# Altium project DCcom.PrjPcb
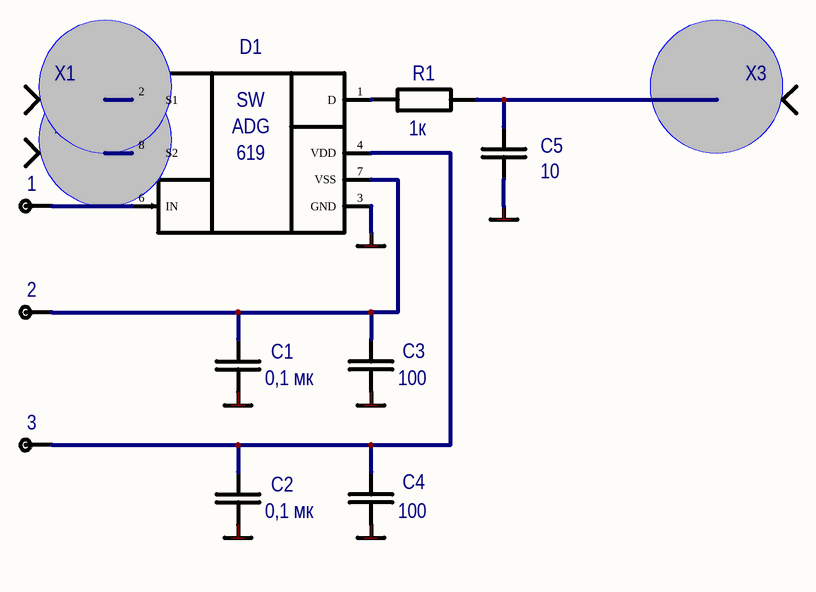
[diagram p0: DCCOM.SchDoc]
1 sheet, 19 parts. Net scope: global (net labels, ports and power ports of the same name join across sheets).
Board file: DCcom0038.PcbDoc

## Sheet DCCOM.SchDoc
size A4; SheetNumber: 1; SheetTotal: 1

### Parts
(Parts that share a designator on the sheet are numbered #1, #2 ... from top to bottom, then left to right.)
1  TP  [TP1]  (value not drawn)  (no BOM)
2  TP  [TP1]  (value not drawn)  (no BOM)
3  TP  [TP1]  (value not drawn)  (no BOM)
*#1  GND  (value not drawn)  (graphical)
*#2  GND  (value not drawn)  (graphical)
*#3  GND  (value not drawn)  (graphical)
*#4  GND  (value not drawn)  (graphical)
*#5  GND  (value not drawn)  (graphical)
*#6  GND  (value not drawn)  (graphical)
C1  0,1 мк  [CAPC1608N]
C2  0,1 мк  [CAPC1608N]
C3  100  [CAPC1005N]
C4  100  [CAPC1005N]
C5  10  [CAPC1608N]
D1  ADG619BRM  [TSOP65P490X110-8N]  (value not drawn)
R1  1к  [RESC1608L]
X1  СРГ-50-751ФВ  [TP0.6X1]  (value not drawn)
X2  СРГ-50-751ФВ  [TP0.6X1]  (value not drawn)
X3  СРГ-50-751ФВ  [TP0.6X1]  (value not drawn)

### Nets
GND: C1.1 C2.1 C3.2 C4.2 C5.1 D1.3(GND)
Net1_1: 1.1 D1.6(IN)
Net2_1: 2.1 C1.2 C3.1 D1.7(VSS)
Net3_1: 3.1 C2.2 C4.1 D1.4(VDD)
NetC5_2: C5.2 R1.1 X3.1
NetD1_1: D1.1(D) R1.2
NetD1_2: D1.2(S1) X1.1
NetD1_8: D1.8(S2) X2.1

### Notes on the sheet
- (in symbol ADG619BRM) SW; ADG; 619

### Library data of the parts
1-3 = TP: Test point
*#1-*#6 = GND: Корпус ЕСКД. Для "наложения" на штатный Power Bar
C1 C2 C5 = C0603: Чип-конденсатор; Name: 0603; Power/Voltage: {Voltage}; TKE/TKC: {TKE/TKC}; Tolerance: {Tolerance}; Value: {Value}; BCPId: *; Manufacturer: *; ManufacturerPartNumber: *; Type: Конденсатор
C3 C4 = C0402: Чип-конденсатор; Name: 0402; Power/Voltage: {Voltage}; TKE/TKC: {TKE/TKC}; Tolerance: {Tolerance}; Value: {Value}; BCPId: *; Manufacturer: *; ManufacturerPartNumber: *; Type: Конденсатор
D1 = ADG619BRM: Single SPDT Switch; Manufacturer: Analog Devices; Type: Микросхема; BCPId: *; Name: *; Package: RM-8; ManufacturerPartNumber: ADG619BRM
R1 = R0603: Чип-резистор; Name: 0603; Tolerance: {Tolerance}; Value: {Value}; BCPId: *; Manufacturer: *; ManufacturerPartNumber: *; Type: Резистор
X1-X3 = СРГ-50-751ФВ: Переход; TU/GOST: ВР0.364.049 ТУ; BCPId: *; Name: *; ManufacturerPartNumber: СРГ-50-751ФВ; Type: Переход